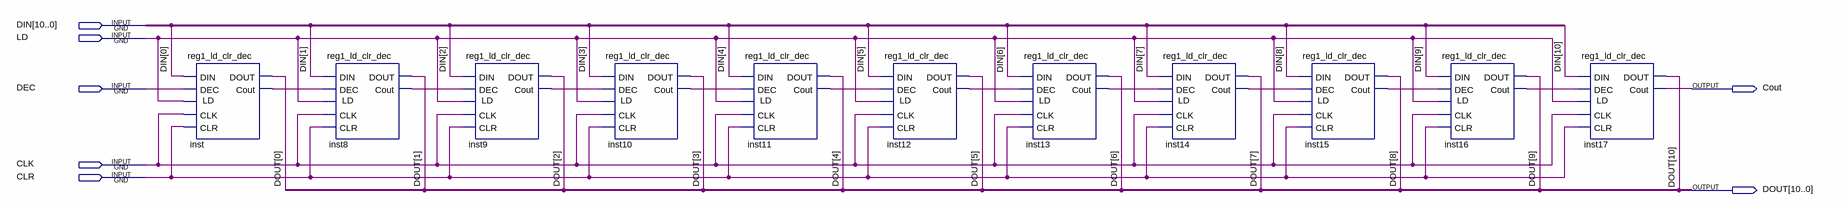
[diagram p0: schematic sheet]
// Quartus schematic reg11_ld_clr_dec.bdf as structural Verilog: 11 symbols, 7 pins
module reg11_ld_clr_dec (
  input  [10:0] DIN,
  input  LD,
  input  DEC,
  input  CLK,
  input  CLR,
  output Cout,
  output [10:0] DOUT
);

  wire inst8_cout, inst9_cout, inst10_cout, inst11_cout, inst12_cout, inst13_cout, inst14_cout, inst15_cout,
       inst16_cout, inst_cout;

  reg1_ld_clr_dec inst (.DIN(DIN[0]), .LD(LD), .DEC(DEC), .CLK(CLK), .CLR(CLR), .Cout(inst_cout), .DOUT(DOUT[0]));
  reg1_ld_clr_dec inst8 (
    .DIN(DIN[1]), .LD(LD), .DEC(inst_cout), .CLK(CLK), .CLR(CLR), .Cout(inst8_cout), .DOUT(DOUT[1]));
  reg1_ld_clr_dec inst9 (
    .DIN(DIN[2]), .LD(LD), .DEC(inst8_cout), .CLK(CLK), .CLR(CLR), .Cout(inst9_cout), .DOUT(DOUT[2]));
  reg1_ld_clr_dec inst10 (
    .DIN(DIN[3]), .LD(LD), .DEC(inst9_cout), .CLK(CLK), .CLR(CLR), .Cout(inst10_cout), .DOUT(DOUT[3]));
  reg1_ld_clr_dec inst11 (
    .DIN(DIN[4]), .LD(LD), .DEC(inst10_cout), .CLK(CLK), .CLR(CLR), .Cout(inst11_cout), .DOUT(DOUT[4]));
  reg1_ld_clr_dec inst12 (
    .DIN(DIN[5]), .LD(LD), .DEC(inst11_cout), .CLK(CLK), .CLR(CLR), .Cout(inst12_cout), .DOUT(DOUT[5]));
  reg1_ld_clr_dec inst13 (
    .DIN(DIN[6]), .LD(LD), .DEC(inst12_cout), .CLK(CLK), .CLR(CLR), .Cout(inst13_cout), .DOUT(DOUT[6]));
  reg1_ld_clr_dec inst14 (
    .DIN(DIN[7]), .LD(LD), .DEC(inst13_cout), .CLK(CLK), .CLR(CLR), .Cout(inst14_cout), .DOUT(DOUT[7]));
  reg1_ld_clr_dec inst15 (
    .DIN(DIN[8]), .LD(LD), .DEC(inst14_cout), .CLK(CLK), .CLR(CLR), .Cout(inst15_cout), .DOUT(DOUT[8]));
  reg1_ld_clr_dec inst16 (
    .DIN(DIN[9]), .LD(LD), .DEC(inst15_cout), .CLK(CLK), .CLR(CLR), .Cout(inst16_cout), .DOUT(DOUT[9]));
  reg1_ld_clr_dec inst17 (
    .DIN(DIN[10]), .LD(LD), .DEC(inst16_cout), .CLK(CLK), .CLR(CLR), .Cout(Cout), .DOUT(DOUT[10]));
endmodule
